# Altium schematic sheet clocking.SchDoc
size A; SheetNumber: 6; SheetTotal: 6
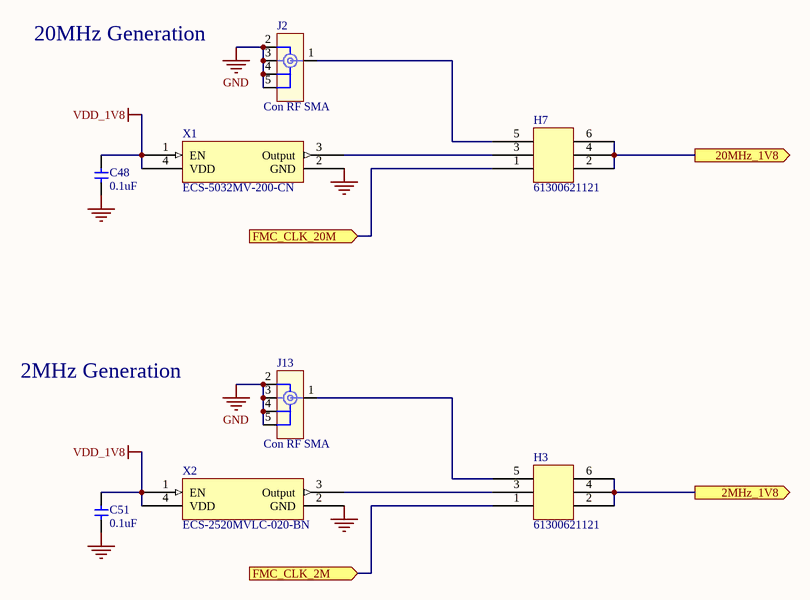
[diagram p0: clocking.SchDoc]

## Parts
C48  0.1uF  [0603]
C51  0.1uF  [0603]
H3  61300621121  [CON-006-100-300X200/2X3-POST]
H7  61300621121  [CON-006-100-300X200/2X3-POST]
J2  Con RF SMA  [CON-001-7.0X7.0/ALL-THT-SMA-ST]
J13  Con RF SMA  [CON-001-7.0X7.0/ALL-THT-SMA-ST]
X1  ECS-5032MV-200-CN  [XTAL-04-5.0X3.2]
X2  ECS-2520MVLC-020-BN  [XTAL-04-2.5X2.0]

## Ports
2MHz_1V8 (out), 20MHz_1V8 (out), FMC_CLK_2M (in), FMC_CLK_20M (in)

## Nets
GND: C48.2 C51.2 J2.2 J2.3 J2.4 J2.5 J13.2 J13.3 J13.4 J13.5 X1.2(GND) X2.2(GND)
VDD_1V8: C48.1 C51.1 X1.1(EN) X1.4(VDD) X2.1(EN) X2.4(VDD)
2MHz_1V8: H3.2 H3.4 H3.6 ; port 2MHz_1V8
20MHz_1V8: H7.2 H7.4 H7.6 ; port 20MHz_1V8
FMC_CLK_2M: H3.1 ; port FMC_CLK_2M
FMC_CLK_20M: H7.1 ; port FMC_CLK_20M
NetH3_3: H3.3 X2.3(Output)
NetH3_5: H3.5 J13.1
NetH7_3: H7.3 X1.3(Output)
NetH7_5: H7.5 J2.1

## Notes on the sheet
- 20MHz Generation
- 2MHz Generation

## Library data of the parts
C48 C51 = DISCRETE_C: 0.1uF 0402
J2 J13 = CON_RF_SMA
X1 = ECS-5032MV-200-CN: 20 MHz HCMOS Oscillator, 1.6 - 3.6V
X2 = ECS-2520MVLC-020-BN: 2MHz CMOS Oscillator, 1.6 - 3.6V